# Altium project BT100_Project.PrjPcb
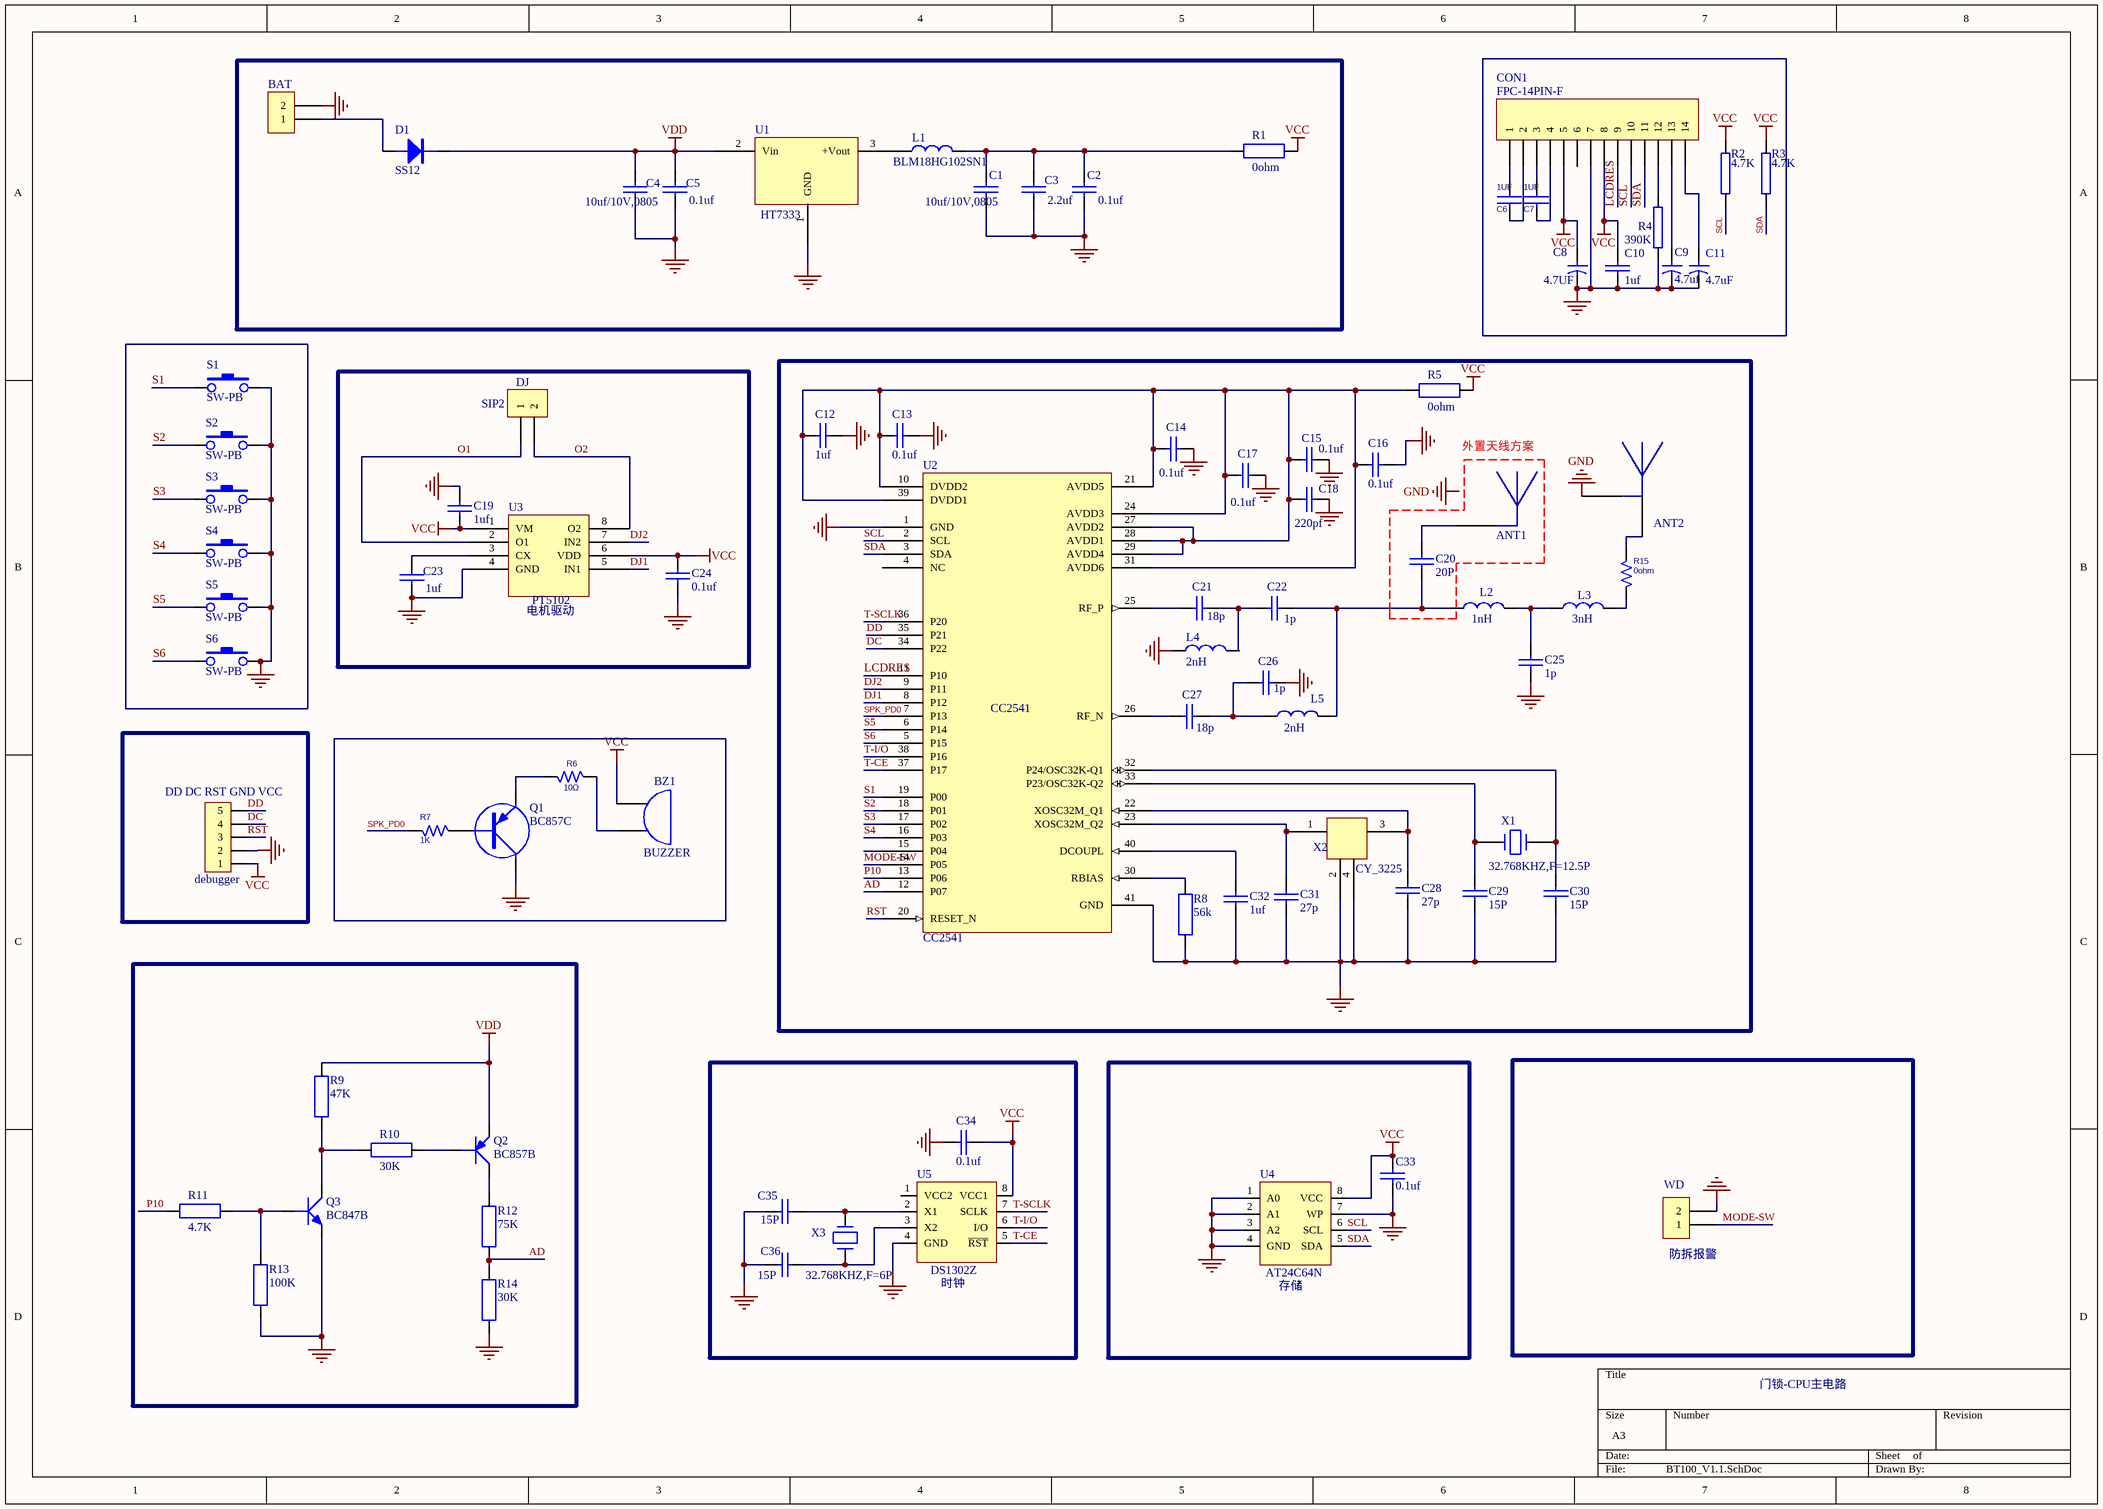
[diagram p0: BT100_V1.1.SchDoc]
1 sheet, 82 parts. Net scope: global (net labels, ports and power ports of the same name join across sheets).
Board file: BT100_V1.1.PCBDOC

## Sheet BT100_V1.1.SchDoc
size A3

### Parts
ANT1  ANT  [IPEX]  (value not drawn)
ANT2  ANT  [ANT]  (value not drawn)
BAT  CN1  [2PAD-9]  (value not drawn)
BZ1  BUZZER  [2PAD-9]
C1  10uf/10V,0805  [PC5-*****-**-0A_0805_TDK]
C2  0.1uf  [PC5-*****-**-0A_0603_TDK]
C3  2.2uf  [PC5-*****-**-0A_0603_TDK]
C4  10uf/10V,0805  [PC5-*****-**-0A_0805_TDK]
C5  0.1uf  [PC5-*****-**-0A_0603_TDK]
C6  1UF  [0603]
C7  1UF  [0603]
C8  4.7UF  [3216C]
C9  4.7uf  [3216C]
C10  1uf  [0603]
C11  4.7uF  [3216C]
C12  1uf  [PC5-*****-**-0A_0603_TDK]
C13  0.1uf  [PC7-*****-KO-0A_0603_TDK]
C14  0.1uf  [PC5-*****-**-0A_0603_TDK]
C15  0.1uf  [PC7-*****-KQA0A_0402_YAGEO]
C16  0.1uf  [PC7-*****-KQA0A_0402_YAGEO]
C17  0.1uf  [PC7-*****-KQA0A_0402_YAGEO]
C18  220pf  [PC7-*****-KQA0A_0402_YAGEO]
C19  1uf  [PC5-*****-**-0A_0603_TDK]
C20  20P  [PC7-*****-KQA0A_0402_YAGEO]
C21  18p  [PC7-*****-KQA0A_0402_YAGEO]
C22  1p  [PC7-*****-KQA0A_0402_YAGEO]
C23  1uf  [PC5-*****-**-0A_0603_TDK]
C24  0.1uf  [PC5-*****-**-0A_0603_TDK]
C25  1p  [PC7-*****-KQA0A_0402_YAGEO]
C26  1p  [PC7-*****-KQA0A_0402_YAGEO]
C27  18p  [PC7-*****-KQA0A_0402_YAGEO]
C28  27p  [PC7-*****-KO-0A_0603_TDK]
C29  15P  [PC5-*****-**-0A_0603_TDK]
C30  15P  [PC7-*****-KO-0A_0603_TDK]
C31  27p  [PC7-*****-KO-0A_0603_TDK]
C32  1uf  [PC5-*****-**-0A_0603_TDK]
C33  0.1uf  [PC5-*****-**-0A_0603_TDK]
C34  0.1uf  [PC7-*****-KO-0A_0603_TDK]
C35  15P  [PC7-*****-KO-0A_0603_TDK]
C36  15P  [PC7-*****-KO-0A_0603_TDK]
CON1  FPC-14PIN-F  [FFC6214]
D1  SS12  [SS12-DIDEO]
DD_DC_RST_GND_VCC  debugger  [ISCP-5PIN]
DJ  SIP2  [2PAD-9]
L1  BLM18HG102SN1  [PC5-*****-**-0A_0603_TDK]
L2  1nH  [PC5-*****-**-0A_0402_TDK]
L3  3nH  [PC5-*****-**-0A_0402_TDK]
L4  2nH  [PC5-*****-**-0A_0402_TDK]
L5  2nH  [PC5-*****-**-0A_0402_TDK]
Q1  BC857C  [PTR-C0025-00-2A_2SC1623]
Q2  BC857B  [PTR-C0025-00-2A_2SC1623]
Q3  BC847B  [PTR-C0025-00-2A_2SC1623]
R1  0ohm  [PC5-*****-**-0A_0603_TDK]
R2  4.7K  [0603]
R3  4.7K  [0603]
R4  390K  [0603]
R5  0ohm  [PRC-*****-AM-0A_0603]
R6  10Ω  [0603]
R7  1K  [0603]
R8  56k  [PRC-*****-BM-0A_0402]
R9  47K  [PC7-*****-KO-0A_0603_TDK]
R10  30K  [PC5-*****-**-0A_0603_TDK]
R11  4.7K  [PC5-*****-**-0A_0603_TDK]
R12  75K  [PC5-*****-**-0A_0603_TDK]
R13  100K  [PC5-*****-**-0A_0603_TDK]
R14  30K  [PC5-*****-**-0A_0603_TDK]
R15  0ohm  [PC7-*****-KQA0A_0402_YAGEO]
S1  SW-PB  [TS-030]
S2  SW-PB  [TS-030]
S3  SW-PB  [TS-030]
S4  SW-PB  [TS-030]
S5  SW-PB  [TS-030]
S6  SW-PB  [TS-030]
U1  HT7333  [SOT89]
U2  CC2541  [CC2530_QFN40]
U3  PT5102  [PT5102]
U4  AT24C64N  [PIC-00570-40-2A_93LC46B]
U5  DS1302Z  [PIC-00570-40-2A_93LC46B]
WD  CN1  [2PAD-9]  (value not drawn)
X1  32.768KHZ,F=12.5P  [FC-135]
X2  CY_3225  [CY_3225]
X3  32.768KHZ,F=6P  [FC-135]

### Blocks framed on the sheet
电机驱动: C19 C23 C24 DJ U3
外置天线方案: ANT1 C20
时钟: C34-C36 U5 X3
存储: C33 U4
防拆报警: WD

### Nets
GND: ANT2.2 BAT.2 C1.1 C2.1 C3.2 C4.1 C5.1 C8.2 C9.2 C10.2 C11.2 C12.2 C13.2 C14.2 C15.2 C16.2 C17.2 C18.1 C19.1 C23.1 C24.1 C25.1 C26.2 C28.1 C29.1 C30.1 C31.1 C32.1 C33.1 C34.2 C35.2 C36.2 CON1.7 DD_DC_RST_GND_VCC.2 L4.1 Q1.C Q3.E R4.1 R8.2 R13.1 R14.1 S1.2 S2.2 S3.2 S4.2 S5.2 S6.2 U1.1(GND) U2.1(GND) U2.41(GND) U3.4(GND) U4.1(A0) U4.2(A1) U4.3(A2) U4.4(GND) U4.7(WP) U5.4(GND) WD.2 X2.2 X2.4
VCC: BZ1.1(A) C8.1 C10.1 C19.2 C24.2 C33.2 C34.1 CON1.5 CON1.8 DD_DC_RST_GND_VCC.1 R1.2 R2.2 R3.2 R5.2 U3.1(VM) U3.6(VDD) U4.8(VCC) U5.8(VCC1)
VDD: C4.2 C5.2 D1.1 Q2.E R9.2 U1.2(Vin)
AD: R12.1 R14.2 U2.12(P07)
DC: DD_DC_RST_GND_VCC.4 U2.34(P22)
DD: DD_DC_RST_GND_VCC.5 U2.35(P21)
DJ1: U2.8(P12) U3.5(IN1)
DJ2: U2.9(P11) U3.7(IN2)
LCDRES: CON1.9 U2.11(P10)
MODE-SW: U2.14(P05) WD.1
O1: DJ.1 U3.2(O1)
O2: DJ.2 U3.8(O2)
P10: R11.1 U2.13(P06)
RST: DD_DC_RST_GND_VCC.3 U2.20(RESET_N)
S1: S1.1 U2.19(P00)
S2: S2.1 U2.18(P01)
S3: S3.1 U2.17(P02)
S4: S4.1 U2.16(P03)
S5: S5.1 U2.6(P14)
S6: S6.1 U2.5(P15)
SCL: CON1.10 R2.1 U2.2(SCL) U4.6(SCL)
SDA: CON1.11 R3.1 U2.3(SDA) U4.5(SDA)
SPK_PD0: R7.1 U2.7(P13)
T-CE: U2.37(P17) U5.5(~{RST})
T-I/O: U2.38(P16) U5.6(I/O)
T-SCLK: U2.36(P20) U5.7(SCLK)
NetANT1_2: ANT1.2 C20.2
NetANT2_1: ANT2.1 R15.1
NetBAT_1: BAT.1 D1.2
NetBZ1_2: BZ1.2(B) R6.2
NetC1_2: C1.2 C2.2 C3.1 L1.2 R1.1
NetC6_1: C6.1 CON1.1
NetC6_2: C6.2 CON1.2
NetC7_1: C7.1 CON1.3
NetC7_2: C7.2 CON1.4
NetC9_1: C9.1 CON1.13
NetC11_1: C11.1 CON1.14
NetC12_1: C12.1 C13.1 C14.1 C15.1 C16.1 C17.1 C18.2 R5.1 U2.10(DVDD2) U2.21(AVDD5) U2.24(AVDD3) U2.27(AVDD2) U2.28(AVDD1) U2.29(AVDD4) U2.31(AVDD6) U2.39(DVDD1)
NetC20_1: C20.1 C22.2 L2.1 L5.2
NetC21_1: C21.1 U2.25(RF_P)
NetC21_2: C21.2 C22.1 L4.2
NetC23_2: C23.2 U3.3(CX)
NetC25_2: C25.2 L2.2 L3.1
NetC26_1: C26.1 C27.2 L5.1
NetC27_1: C27.1 U2.26(RF_N)
NetC28_2: C28.2 U2.22(XOSC32M_Q1) X2.3
NetC29_2: C29.2 U2.33(P23/OSC32K-Q2) X1.1
NetC30_2: C30.2 U2.32(P24/OSC32K-Q1) X1.2
NetC31_2: C31.2 U2.23(XOSC32M_Q2) X2.1
NetC32_2: C32.2 U2.40(DCOUPL)
NetC35_1: C35.1 U5.2(X1) X3.2
NetC36_1: C36.1 U5.3(X2) X3.1
NetCON1_12: CON1.12 R4.2
NetL1_1: L1.1 U1.3(+Vout)
NetL3_2: L3.2 R15.2
NetQ1_B: Q1.B R7.2
NetQ1_E: Q1.E R6.1
NetQ2_B: Q2.B R10.2
NetQ2_C: Q2.C R12.2
NetQ3_B: Q3.B R11.2 R13.2
NetQ3_C: Q3.C R9.1 R10.1
NetR8_1: R8.1 U2.30(RBIAS)

Not connected (* = marked no-connect by the designer): CON1 6; U2 4(NC) 15(P04); U5 1(VCC2)

### Notes on the sheet
- 门锁-CPU主电路
- Labels drawn without touching a wire or pin: GND

### Library data of the parts
ANT1 = ANT1
BAT DJ WD = CON2: Connector
C1-C5 C12-C36 = PC7_0402_YAGEO: PC7-*****-KQA0A
C6 C7 = CAP NP_Dup3: Right: 20; Bottom: 10
C8 C9 C11 = CAP_E: 1206
C10 = CAP: Capacitor
CON1 = CON14: Connector
D1 = PDD_SD101CWS: PDD-00330-00-2A
DD_DC_RST_GND_VCC = CON5
L1-L5 = PWL_18nH: PWL-00195-00-20
Q1 = PNP: PNP Transistor
Q2 = PTR-PNP
Q3 = PTR_2SC3356: PTR-C0028-00-2A
R1 R5 R8-R14 = PRC_0603: PRC-*****-AM-0A_0603; Text Field1: pristel=\Models.lib
R2-R4 = RES
R6 R7 R15 = R_Dup3: PSpiceTemplate: R^@REFDES %1 %2 ?TOLERANCE|R^@REFDES| @VALUE  ?TOLERANCE|\n.model R^@REFDES RES R=1 DEV=@TOLERANCE%|; Right: 20; Bottom: 20
U1 = LM117K
U3 = Component_1_1
U5 = DS1302
X1 = CRYSTAL
X3 = PTR_16MHZ: PTR-X0320-20-2A